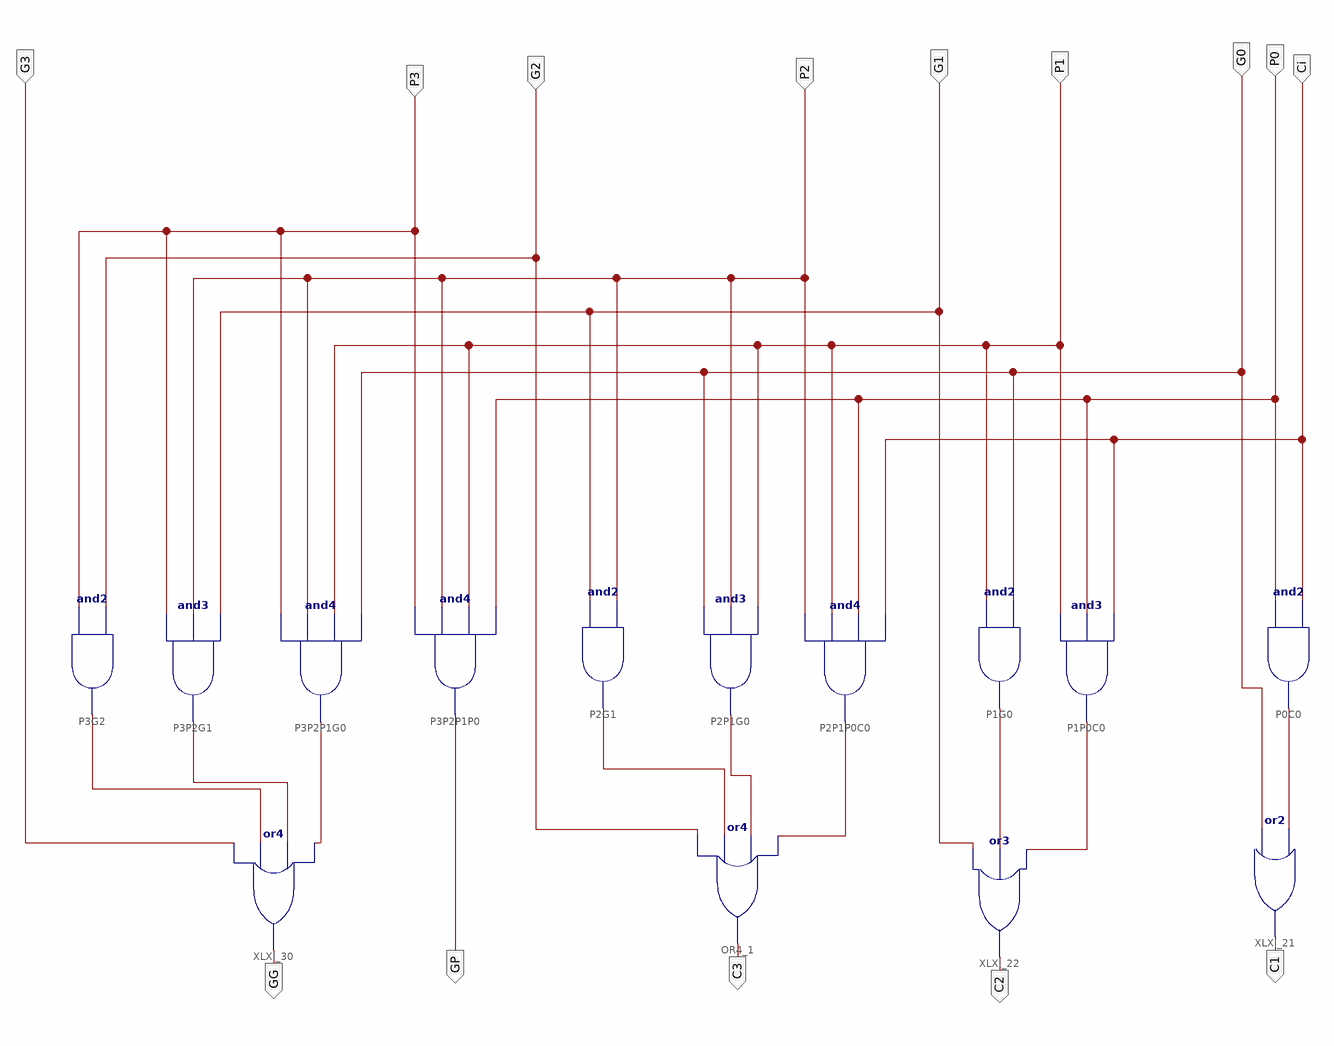
[diagram p0: schematic sheet 1]
// Xilinx ISE schematic CLA.sch (kintex7) as structural Verilog: 14 symbols, 14 ports
module CLA (
  input  P0,
  input  Ci,
  input  G0,
  input  G1,
  input  P1,
  input  P2,
  input  P3,
  input  G2,
  input  G3,
  output C1,
  output C2,
  output C3,
  output GP,
  output GG
);

  wire XLXN_3, XLXN_12, XLXN_13, XLXN_18, XLXN_22, XLXN_23, XLXN_27, XLXN_28, XLXN_29;

  and P3G2 (XLXN_29, P3, G2);
  and P2G1 (XLXN_18, G1, P2);
  and P1G0 (XLXN_12, P1, G0);
  and P0C0 (XLXN_3, P0, Ci);
  or XLXI_21 (C1, G0, XLXN_3);
  or XLXI_22 (C2, G1, XLXN_12, XLXN_13);
  and P1P0C0 (XLXN_13, P1, P0, Ci);
  and P2P1G0 (XLXN_22, G0, P2, P1);
  and P2P1P0C0 (XLXN_23, P2, P1, P0, Ci);
  or OR4_1 (C3, G2, XLXN_18, XLXN_22, XLXN_23);
  and P3P2P1P0 (GP, P3, P2, P1, P0);
  and P3P2P1G0 (XLXN_27, P3, P2, P1, G0);
  and P3P2G1 (XLXN_28, P3, P2, G1);
  or XLXI_30 (GG, G3, XLXN_29, XLXN_28, XLXN_27);
endmodule
